# Altium schematic sheet Sheet.SchDoc
size A4
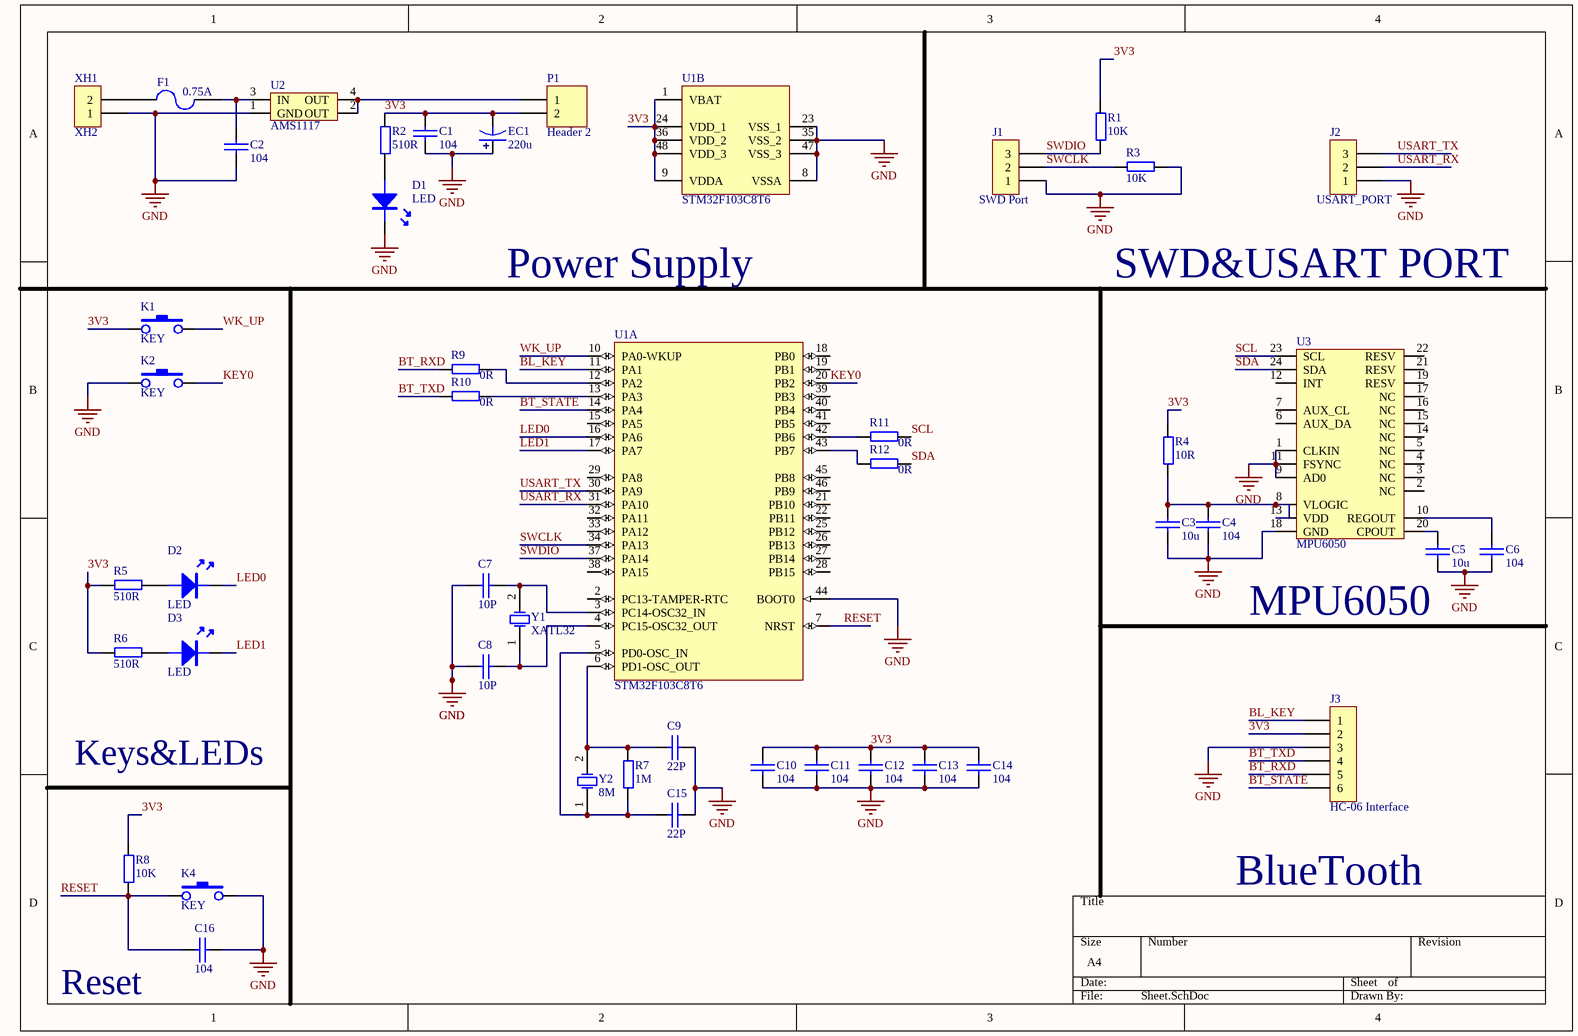
[diagram p0: Sheet.SchDoc]

## Parts
C1  104  [0805C]
C2  104  [0805C]
C3  10u  [0805C]
C4  104  [0805C]
C5  10u  [0805C]
C6  104  [0805C]
C7  10P  [0805C]
C8  10P  [0805C]
C9  22P  [0805C]
C10  104  [0805C]
C11  104  [0805C]
C12  104  [0805C]
C13  104  [0805C]
C14  104  [0805C]
C15  22P  [0805C]
C16  104  [0805C]
D1  LED  [LED-0805R]
D2  LED  [LED-0805R]
D3  LED  [LED-0805R]
EC1  220u  [SMD-EC5.0X5.3X5.4]
F1  0.75A  [FUSE-1210]
J1  SWD Port  [Pin HDR1X3/2.54mm-S]
J2  USART_PORT  [Pin HDR1X3/2.54mm-S]
J3  HC-06 Interface  [Fe-HDR1X6/2.54-S]
K1  KEY  [SMD-3X6X4.3]
K2  KEY  [SMD-3X6X4.3]
K4  KEY  [SMD-3X6X4.3]
P1  Header 2  [HDR1X2]
R1  10K  [0805]
R2  510R  [0805]
R3  10K  [0805]
R4  10R  [0805]
R5  510R  [0805]
R6  510R  [0805]
R7  1M  [0805]
R8  10K  [0805]
R9  0R  [0603P]
R10  0R  [0603P]
R11  0R  [0603P]
R12  0R  [0603P]
U1  STM32F103C8T6  [STM-LQFP48_N]  (parts A,B of 2)
U2  AMS1117  [AMS1117]
U3  MPU6050  [QFN24]
XH1  XH2  [XH2/2.54mm/180]
Y1  XATL32  [XTAL32]
Y2  8M  [49S_SMD]

## Nets
GND: C1.1 C2.1 C3.1 C4.1 C5.1 C6.1 C7.1 C8.1 C9.2 C10.1 C11.1 C12.1 C13.1 C14.1 C15.2 C16.1 D1.K EC1.1 J1.1 J2.1 J3.3 K2.1 K4.3 R3.1 U1.8(VSSA) U1.23(VSS_1) U1.35(VSS_2) U1.44(BOOT0) U1.47(VSS_3) U2.1(GND) U3.1(CLKIN) U3.9(AD0) U3.11(FSYNC) U3.18(GND) XH1.1
3V3: C1.2 C10.2 C11.2 C12.2 C13.2 C14.2 EC1.2 J3.2 K1.1 P1.2 R1.2 R2.2 R4.2 R5.2 R6.2 R8.2 U1.1(VBAT) U1.9(VDDA) U1.24(VDD_1) U1.36(VDD_2) U1.48(VDD_3)
BL_KEY: J3.1 U1.11(PA1)
BT_RXD: J3.5 R9.2
BT_STATE: J3.6 U1.14(PA4)
BT_TXD: J3.4 R10.2
KEY0: K2.3 U1.20(PB2)
LED0: D2.K U1.16(PA6)
LED1: D3.K U1.17(PA7)
RESET: C16.2 K4.1 R8.1 U1.7(NRST)
SCL: R11.1 U3.23(SCL)
SDA: R12.1 U3.24(SDA)
SWCLK: J1.2 R3.2 U1.34(PA13)
SWDIO: J1.3 R1.1 U1.37(PA14)
USART_RX: J2.2 U1.31(PA10)
USART_TX: J2.3 U1.30(PA9)
WK_UP: K1.3 U1.10(PA0-WKUP)
NetC2_2: C2.2 F1.2 U2.3(IN)
NetC3_2: C3.2 C4.2 R4.1 U3.8(VLOGIC) U3.13(VDD)
NetC5_2: C5.2 U3.20(CPOUT)
NetC6_2: C6.2 U3.10(REGOUT)
NetC7_2: C7.2 U1.3(PC14-OSC32_IN) Y1.2(OSC2)
NetC8_2: C8.2 U1.4(PC15-OSC32_OUT) Y1.1(OSC1)
NetC9_1: C9.1 R7.2 U1.6(PD1-OSC_OUT) Y2.2(OSC2)
NetC15_1: C15.1 R7.1 U1.5(PD0-OSC_IN) Y2.1(OSC1)
NetD1_A: D1.A R2.1
NetD2_A: D2.A R5.1
NetD3_A: D3.A R6.1
NetF1_1: F1.1 XH1.2
NetP1_1: P1.1 U2.2(OUT) U2.4(OUT)
NetR9_1: R9.1 U1.12(PA2)
NetR10_1: R10.1 U1.13(PA3)
NetR11_2: R11.2 U1.42(PB6)
NetR12_2: R12.2 U1.43(PB7)

Not connected (* = marked no-connect by the designer): U1 2(PC13-TAMPER-RTC) 15(PA5) 18(PB0) 19(PB1) 21(PB10) 22(PB11) 25(PB12) 26(PB13) 27(PB14) 28(PB15) 29(PA8) 32(PA11) 33(PA12) 38(PA15) 39(PB3) 40(PB4) 41(PB5) 45(PB8) 46(PB9); U3 2(NC) 3(NC) 4(NC) 5(NC) 6(AUX_DA) 7(AUX_CL) 12(INT) 14(NC) 15(NC) 16(NC) 17(NC) 19(RESV) 21(RESV) 22(RESV)

## Notes on the sheet
- Power Supply
- SWD&USART PORT
- MPU6050
- Keys&LEDs
- BlueTooth
- (near C16) Reset

## Library data of the parts
C1-C16 = CAP: 无极性电容
EC1 = SMD_ECAP: 贴片电解电容
F1 = FUSE
J1 J2 = Pin HDR1X3
J3 = Female HDR1X6
P1 = Header 2: Header, 2-Pin; LatestRevisionDate: *; LatestRevisionNote: *; Publisher: *
R1-R12 = R
U1 = STM32F103C8T6: ARM Cortex-M3 32-bit MCU, 64 KB Flash, 20 KB Internal RAM, 37 I/Os, 48-pin LQFP, -40 to 85 degC, Tray; A/D Converter: 2x12-bit (10 Channel); FLASH Size (Prog) (kB): 64; I/Os (High Current): 37; Internal RAM Size (kB): 20; Operating Frequency(F) (Processor speed) (MHz): 72; Supply Voltage(Vcc) min (V): 2; DatasheetVersion: Rev. 16; PackageVersion: Rev. 6, 06/2013; PackageReference: LQFP48; PackageDescription: 48-Pin Low Profile Quad Flat Package, 7 x 7 mm Body, 0.5 mm Pitch; Supplier 1: Digi-Key; Supplier Part Number 1: 497-6063-ND; Supplier 2: Farnell; Supplier Part Number 2: 1447637; Supplier 3: Newark; Supplier Part Number 3: 59M2182; Supplier 4: Newark; Supplier Part Number 4: 57P1222; Supplier 5: Mouser; Supplier Part Number 5: 511-STM32F103C8T6; Core: ARM Cortex-M3; Packing: Tray; Mounting Technology: Surface Mount; PartNumber: STM32F103C8T6; ComponentLink1Description: Manufacturer URL; ComponentLink1URL: http://www.st.com/web/en/home.html; ComponentLink2Description: Datasheet; ComponentLink2URL: http://www.st.com/st-web-ui/static/active/en/resource/technical/document/datasheet/CD00161566.pdf; ComponentLink3Description: Package Specification; ComponentLink3URL: http://www.st.com/st-web-ui/static/active/en/resource/technical/document/datasheet/DM00058181.pdf
U3 = MPU6050: 9轴运动处理传感器
Y1 = XTAL_1: Crystal Oscillator; Published: *; LatestRevisionDate: *; LatestRevisionNote: *; Publisher: *
Y2 = XTAL: Crystal Oscillator; Published: *; LatestRevisionDate: *; LatestRevisionNote: *; Publisher: *